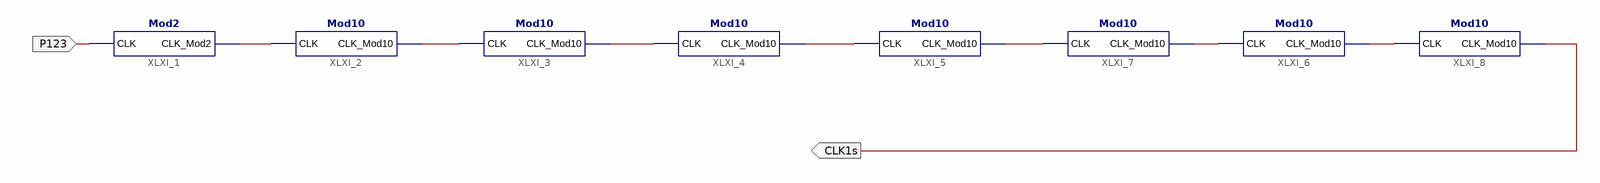
[diagram p0: schematic sheet 1]
// Xilinx ISE schematic time1s.sch (spartan6) as structural Verilog: 8 symbols, 2 ports
module time1s (
  input  P123,
  output CLK1s
);

  wire XLXN_1, XLXN_2, XLXN_3, XLXN_4, XLXN_6, XLXN_12, XLXN_13;

  Mod2 XLXI_1 (.CLK(P123), .CLK_Mod2(XLXN_1));
  Mod10 XLXI_2 (.CLK(XLXN_1), .CLK_Mod10(XLXN_2));
  Mod10 XLXI_3 (.CLK(XLXN_2), .CLK_Mod10(XLXN_3));
  Mod10 XLXI_4 (.CLK(XLXN_3), .CLK_Mod10(XLXN_4));
  Mod10 XLXI_5 (.CLK(XLXN_4), .CLK_Mod10(XLXN_6));
  Mod10 XLXI_6 (.CLK(XLXN_12), .CLK_Mod10(XLXN_13));
  Mod10 XLXI_7 (.CLK(XLXN_6), .CLK_Mod10(XLXN_12));
  Mod10 XLXI_8 (.CLK(XLXN_13), .CLK_Mod10(CLK1s));
endmodule
